# EasyEDA Pro project easyEdaProject.eprj

# Schematic Schematic1
Board Name: Board1; Create Date: 2025-03-09; Page Name: P1; Project Name: easyEdaProject; Schematic Name: Schematic1; Update Date: 2025-03-10; Company: EasyEDA.com; Page Size: A4; Version: V1.0
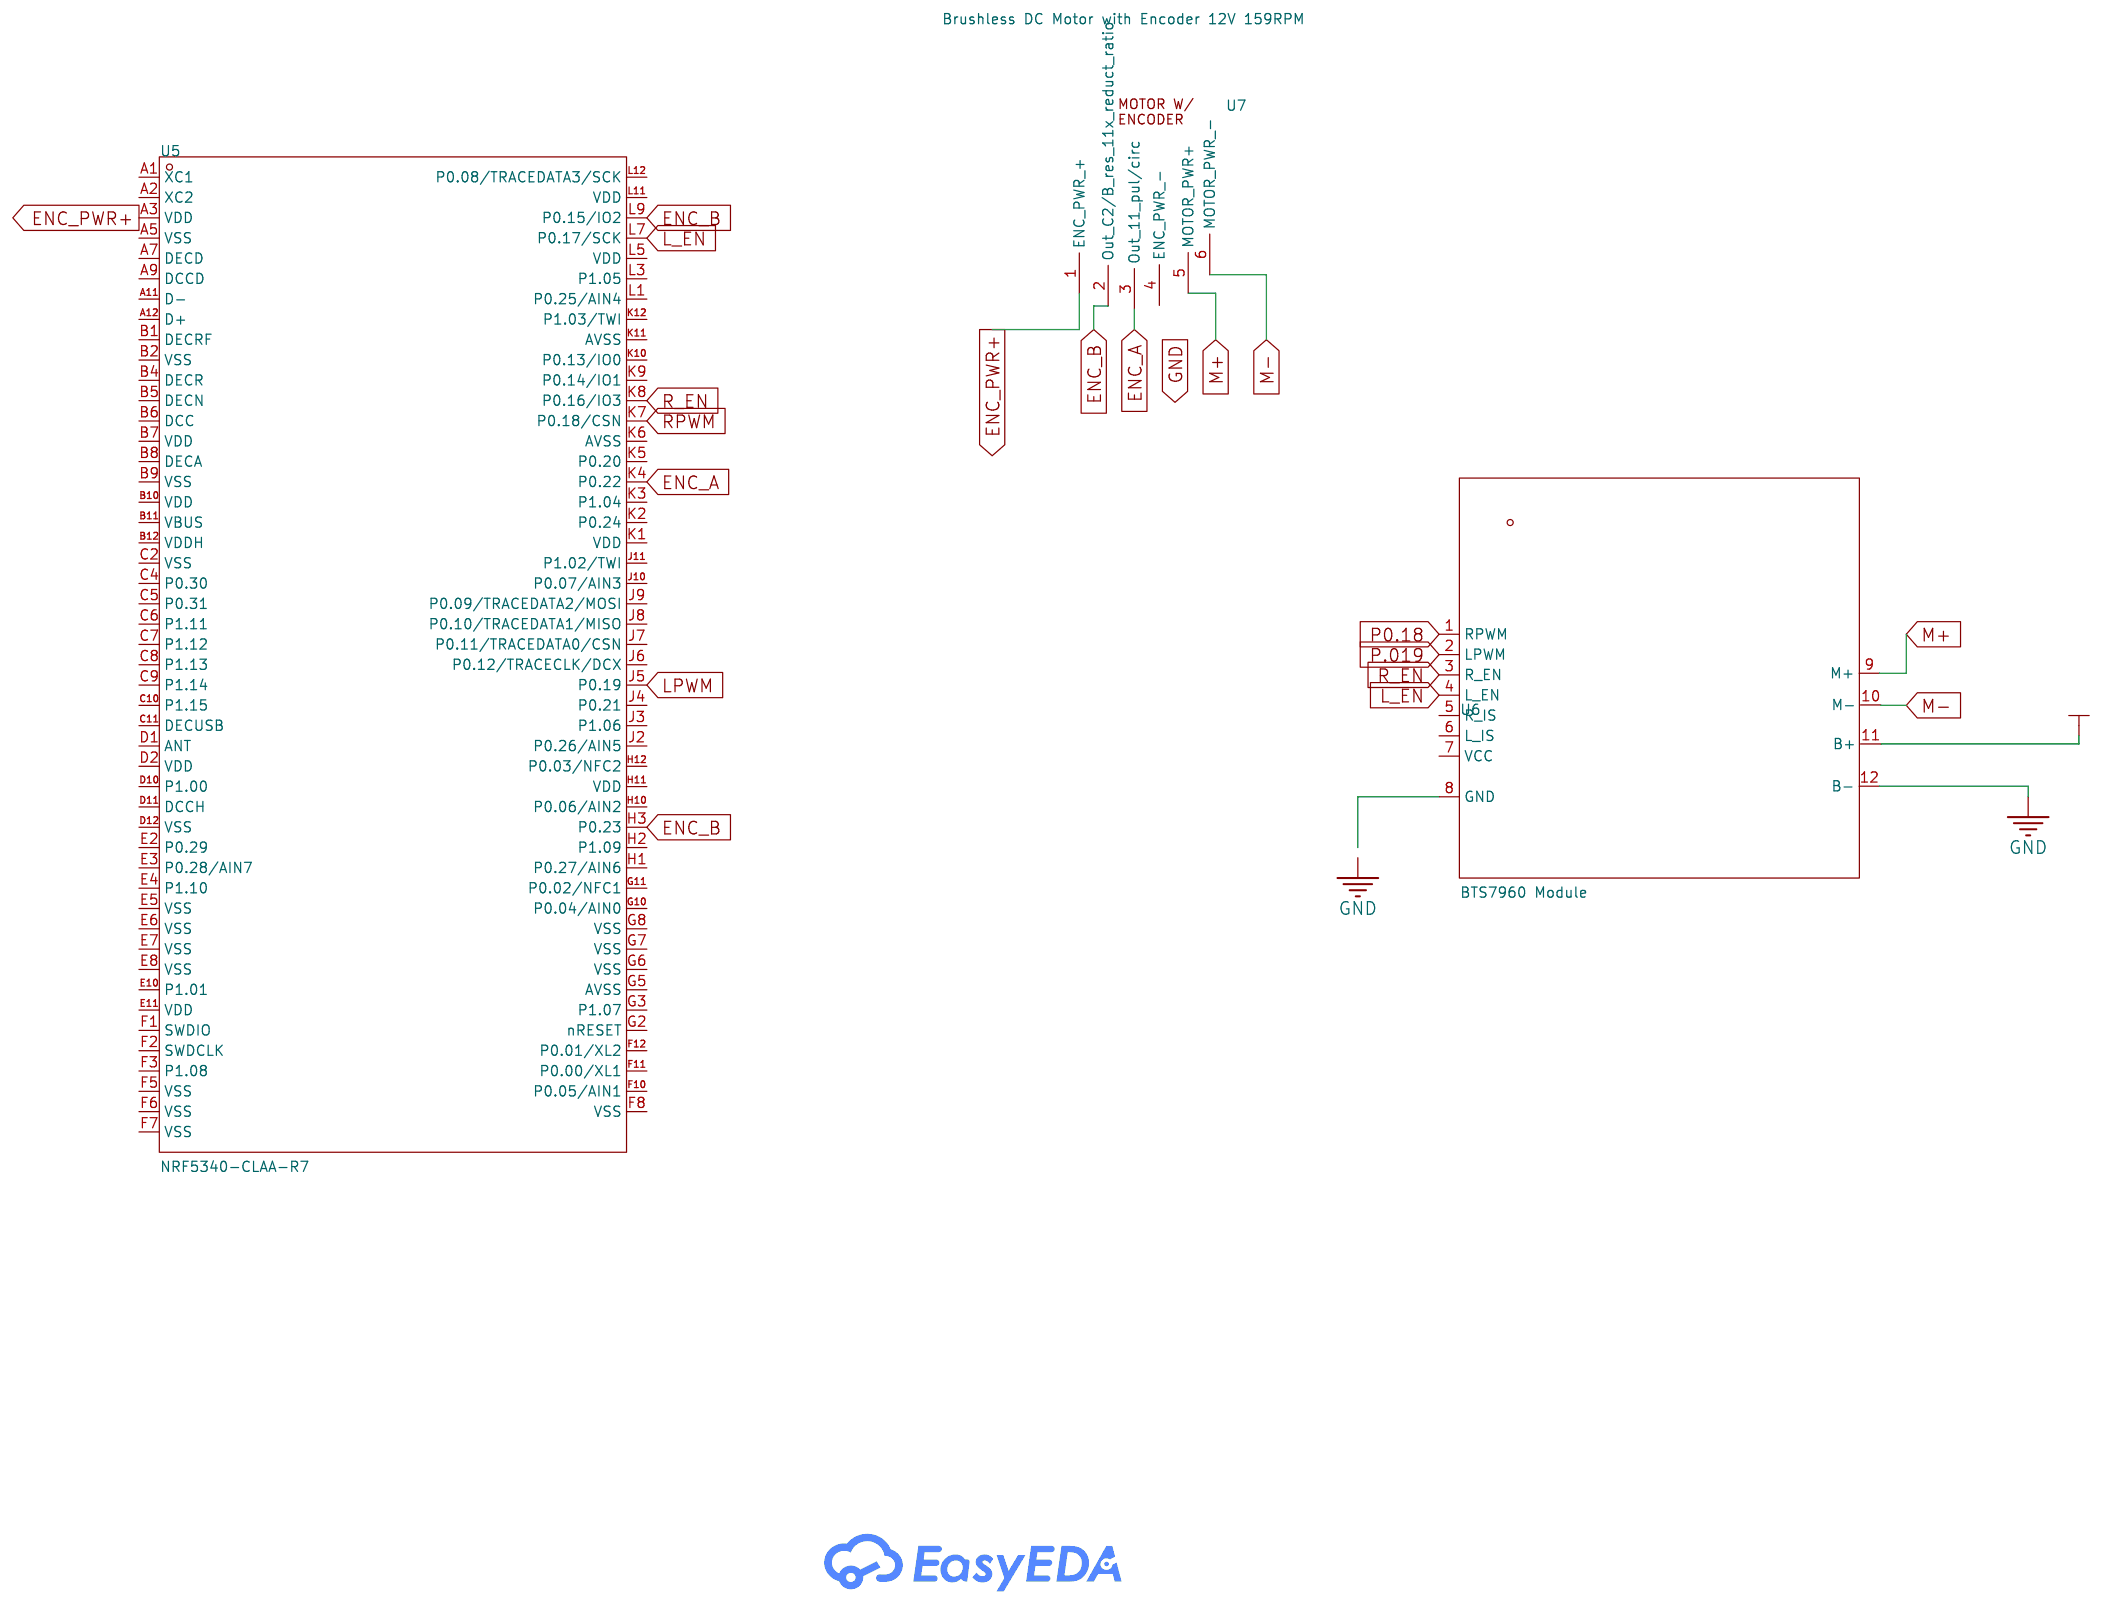
[diagram p0: schematic sheet]

## Parts
U5  NRF5340-CLAA-R7  [WLCSP-94_L4.4-W4.0-P0.35-TL_NRF5340]
U6  BTS7960 Module  [TO-263-7_L10.2-W10.4-P1.27-LS14.4-TL]
U7  Brushless DC Motor with Encoder 12V 159RPM

## Library data of the parts
U5 = NRF5340-CLAA-R7: Supplier Part: C3606790; Manufacturer: NORDIC; JLCPCB Part Class: Extended Part; Datasheet: https://atta.szlcsc.com/upload/public/pdf/source/20240407/1CBEBA12D2FB65F092CFBF0FFD00CF2D.pdf; Supplier: LCSC; Interface: ADC,I2S,PWM,SPI,UART,USB; Operating Voltage: 1.7V~5.5V; Applications: 802.15.4；蓝牙; Output Power: 3dBm; Data Rate: 2Mbps; Current Of Transmitting: 3.2mA; Sensitivity: -97.5dBm; Receive Current: 2.6mA; Typical Application Frequency: 2.4GHz; Operating Temperature: -40℃~+105℃
U6 = BTN7960B: LCSC Part Name: BTN7960B 停产 停产; Supplier Part: C648660; Manufacturer: Infineon(英飞凌); Supplier Footprint: TO-263-7; JLCPCB Part Class: Extended Part; Datasheet: https://atta.szlcsc.com/upload/public/pdf/source/20200615/C609523_7E4778E1B1FED2EEDD6EB84641CD747A.pdf; Supplier: LCSC
U7 = Brushless DC Motor with Encoder 12V 159RPM: Manufacturer: DFRobot; Manufacturer Part: FIT0441; Supplier: DFRobot; Supplier Part: FIT0441; link: https://wiki.dfrobot.com/FIT0441_Brushless_DC_Motor_with_Encoder_12V_159RPM

## Nets
12V: U6.11(B+)
GND: U6.12(B-)
ENC_A: U5.K4(P0.22) U7.3(Out 11 pul/circ)
ENC_B: U5.H3(P0.23) U5.L9(P0.15/IO2) U7.2(Out C2/B res 11x reduct ratio)
ENC_PWR+: U5.A3(VDD) U7.1(ENC PWR +)
L_EN: U5.L7(P0.17/SCK) U6.4(L EN)
LPWM: U5.J5(P0.19)
M+: U6.9(M+) U7.5(MOTOR PWR+)
M-: U7.6(MOTOR PWR -)
P0.18: U6.1(RPWM)
P.019: U6.2(LPWM)
R_EN: U5.K8(P0.16/IO3) U6.3(R EN)
RPWM: U5.K7(P0.18/CSN)

Not connected (* = marked no-connect by the designer): U5 A1(XC1) A2(XC2) A5(VSS) A7(DECD) A9(DCCD) A11(D-) A12(D+) B1(DECRF) B2(VSS) B4(DECR) B5(DECN) B6(DCC) B7(VDD) B8(DECA) B9(VSS) B10(VDD) B11(VBUS) B12(VDDH) C2(VSS) C4(P0.30) C5(P0.31) C6(P1.11) C7(P1.12) C8(P1.13) C9(P1.14) C10(P1.15) C11(DECUSB) D1(ANT) D2(VDD) D10(P1.00) D11(DCCH) D12(VSS) E2(P0.29) E3(P0.28/AIN7) E4(P1.10) E5(VSS) E6(VSS) E7(VSS) E8(VSS) E10(P1.01) E11(VDD) F1(SWDIO) F2(SWDCLK) F3(P1.08) F5(VSS) F6(VSS) F7(VSS) F8(VSS) F10(P0.05/AIN1) F11(P0.00/XL1) F12(P0.01/XL2) G2(nRESET) G3(P1.07) G5(AVSS) G6(VSS) G7(VSS) G8(VSS) G10(P0.04/AIN0) G11(P0.02/NFC1) H1(P0.27/AIN6) H2(P1.09) H10(P0.06/AIN2) H11(VDD) H12(P0.03/NFC2) J2(P0.26/AIN5) J3(P1.06) J4(P0.21) J6(P0.12/TRACECLK/DCX) J7(P0.11/TRACEDATA0/CSN) J8(P0.10/TRACEDATA1/MISO) J9(P0.09/TRACEDATA2/MOSI) J10(P0.07/AIN3) J11(P1.02/TWI) K1(VDD) K2(P0.24) K3(P1.04) K5(P0.20) K6(AVSS) K9(P0.14/IO1) K10(P0.13/IO0) K11(AVSS) K12(P1.03/TWI) L1(P0.25/AIN4) L3(P1.05) L5(VDD) L11(VDD) L12(P0.08/TRACEDATA3/SCK); U6 5(R IS) 6(L IS) 7(VCC) 8(GND) 10(M-); U7 4(ENC PWR -)
